# Altium schematic sheet Motor_MCU.SchDoc: Motor MCU
size A4; Author: wgl18; DrawnBy: wgl18; Organization: ENEL429 Group 9; Address1: ECE Department; Address2: University of Canterbury; Address3: Christchurch 8041; Address4: New Zealand; DocumentNumber: 1; Revision: 1; SheetNumber: 2; SheetTotal: 5; ProjectName: Wacky Racers
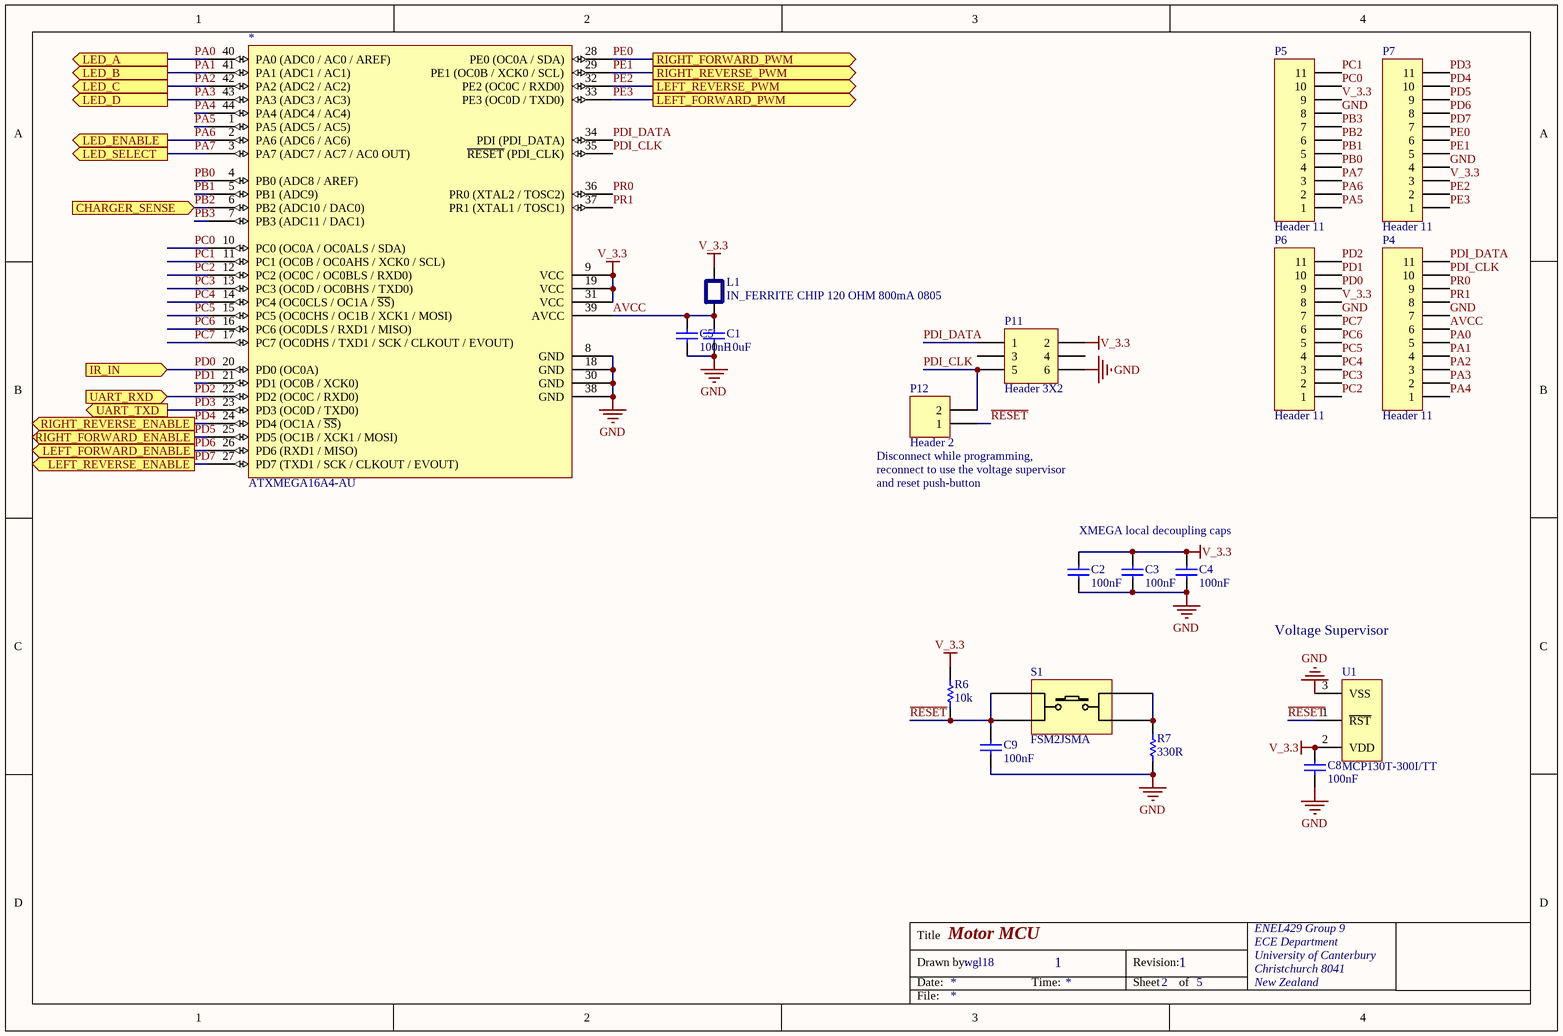
[diagram p0: Motor_MCU.SchDoc]

## Parts
*  ATXMEGA16A4-AU  [TQFP80P1200X1200X120-44N]
C1  10uF  [0805]
C2  100nF  [0603]
C3  100nF  [0603]
C4  100nF  [0603]
C5  100nF  [0603]
C8  100nF  [0603]
C9  100nF  [0603]
L1  IN_FERRITE CHIP 120 OHM 800mA 0805  [0805]
P4  Header 11  [HDR1X11]
P5  Header 11  [HDR1X11]
P6  Header 11  [HDR1X11]
P7  Header 11  [HDR1X11]
P11  Header 3X2  [HDR2X3]
P12  Header 2  [HDR1X2]
R6  10k  [0603]
R7  330R  [0603]
S1  FSM2JSMA  [FSM2JSMA]
U1  MCP130T-300I/TT  [SOT-23-TT3_N]

## Ports
CHARGER_SENSE (in), IR_IN (in), LED_A (out), LED_B (out), LED_C (out), LED_D (out), LED_ENABLE (out), LED_SELECT (out), LEFT_FORWARD_ENABLE (out), LEFT_FORWARD_PWM (out), LEFT_REVERSE_ENABLE (out), LEFT_REVERSE_PWM (out), RIGHT_FORWARD_ENABLE (out), RIGHT_FORWARD_PWM (out), RIGHT_REVERSE_ENABLE (out), RIGHT_REVERSE_PWM (out), UART_RXD (in), UART_TXD (out)

## Nets
GND: *.8(GND) *.18(GND) *.30(GND) *.38(GND) C1.2 C2.1 C3.1 C4.1 C5.1 C8.2 C9.2 P4.7 P5.8 P6.7 P7.4 P11.6 R7.1 U1.3(VSS)
V_3.3: *.9(VCC) *.19(VCC) *.31(VCC) C2.2 C3.2 C4.2 C8.1 L1.1 P5.9 P6.8 P7.3 P11.2 R6.2 U1.2(VDD)
AVCC: *.39(AVCC) C1.1 C5.2 L1.2 P4.6
PA0: *.40(PA0_(ADC0_/_AC0_/_AREF)) P4.5 ; port LED_A
PA1: *.41(PA1_(ADC1_/_AC1)) P4.4 ; port LED_B
PA2: *.42(PA2_(ADC2_/_AC2)) P4.3 ; port LED_C
PA3: *.43(PA3_(ADC3_/_AC3)) P4.2 ; port LED_D
PA4: *.44(PA4_(ADC4_/_AC4)) P4.1
PA5: *.1(PA5_(ADC5_/_AC5)) P5.1
PA6: *.2(PA6_(ADC6_/_AC6)) P5.2 ; port LED_ENABLE
PA7: *.3(PA7_(ADC7_/_AC7_/_AC0_OUT)) P5.3 ; port LED_SELECT
PB0: *.4(PB0_(ADC8_/_AREF)) P5.4
PB1: *.5(PB1_(ADC9)) P5.5
PB2: *.6(PB2_(ADC10_/_DAC0)) P5.6 ; port CHARGER_SENSE
PB3: *.7(PB3_(ADC11_/_DAC1)) P5.7
PC0: *.10(PC0_(OC0A_/_OC0ALS_/_SDA)) P5.10
PC1: *.11(PC1_(OC0B_/_OC0AHS_/_XCK0_/_SCL)) P5.11
PC2: *.12(PC2_(OC0C_/_OC0BLS_/_RXD0)) P6.1
PC3: *.13(PC3_(OC0D_/_OC0BHS_/_TXD0)) P6.2
PC4: *.14(PC4_(OC0CLS_/_OC1A_/_~{SS})) P6.3
PC5: *.15(PC5_(OC0CHS_/_OC1B_/_XCK1_/_MOSI)) P6.4
PC6: *.16(PC6_(OC0DLS_/_RXD1_/_MISO)) P6.5
PC7: *.17(PC7_(OC0DHS_/_TXD1_/_SCK_/_CLKOUT_/_EVOUT)) P6.6
PD0: *.20(PD0_(OC0A)) P6.9 ; port IR_IN
PD1: *.21(PD1_(OC0B_/_XCK0)) P6.10
PD2: *.22(PD2_(OC0C_/_RXD0)) P6.11 ; port UART_RXD
PD3: *.23(PD3_(OC0D_/_TXD0)) P7.11 ; port UART_TXD
PD4: *.24(PD4_(OC1A_/_~{SS})) P7.10 ; port RIGHT_REVERSE_ENABLE
PD5: *.25(PD5_(OC1B_/_XCK1_/_MOSI)) P7.9 ; port RIGHT_FORWARD_ENABLE
PD6: *.26(PD6_(RXD1_/_MISO)) P7.8 ; port LEFT_FORWARD_ENABLE
PD7: *.27(PD7_(TXD1_/_SCK_/_CLKOUT_/_EVOUT)) P7.7 ; port LEFT_REVERSE_ENABLE
PDI_CLK: *.35(~{RESET}_(PDI_CLK)) P4.10 P11.5 P12.2
PDI_DATA: *.34(PDI_(PDI_DATA)) P4.11 P11.1
PE0: *.28(PE0_(OC0A_/_SDA)) P7.6 ; port RIGHT_FORWARD_PWM
PE1: *.29(PE1_(OC0B_/_XCK0_/_SCL)) P7.5 ; port RIGHT_REVERSE_PWM
PE2: *.32(PE2_(OC0C_/_RXD0)) P7.2 ; port LEFT_REVERSE_PWM
PE3: *.33(PE3_(OC0D_/_TXD0)) P7.1 ; port LEFT_FORWARD_PWM
PR0: *.36(PR0_(XTAL2_/_TOSC2)) P4.9
PR1: *.37(PR1_(XTAL1_/_TOSC1)) P4.8
~{RESET}: C9.1 P12.1 R6.1 S1.1 S1.2 U1.1(~{RST})
NetR7_2: R7.2 S1.3 S1.4

Not connected (* = marked no-connect by the designer): P11 3 4

## Notes on the sheet
- (near P12) Disconnect while programming,
- (near P12) reconnect to use the voltage supervisor
- and reset push-button
- XMEGA local decoupling caps
- Voltage Supervisor
- Title
- Drawn by:
- Date:
- Time:
- Revision:
- Sheet
- of
- File:

## Library data of the parts
* = ATXMEGA16A4-AU: Manufacturer: ATMEL; Manufacturer PN: ATXMEGA16A4-AU; Supplier 1: Element 14; Supplier Part Number 1: 1748552
C1 = CP_10uF 0805: CAP 10uF 10% 10V X5R 0805; Manufacturer: Murata; Manufacturer PN: GRM219R61A106KE44D; Value: 10uF; Part Number: CP_10uF 0805; Component Kind: Standard; Component Type: Standard; Designator: CP_10uF 0805; Pin Count: 2; LatestRevisionDate: 29 May 08; Supplier 1: Digi-Key; Supplier Part Number 1: 490-4735-1-ND
C2-C5 C8 C9 = CP_100nF 0603: CAP CER .10UF 50V X5R 0603; Manufacturer: Taiyo Yuden; Manufacturer PN: UMK107B7104KA-T; Value: 100nF; Part Number: CP_100nF 0603; Component Kind: Standard; Component Type: Standard; Designator: CP_100nF 0603; Pin Count: 2; LatestRevisionDate: 29 May 08; Supplier 1: Digi-Key; Supplier Part Number 1: 478-6206-1-ND; Signal Integrity: Cap; Simulation: CAP
L1 = IN_FERRITE CHIP 120 OHM 800mA 0805: FERRITE CHIP 120 OHM 800mA 0805; Manufacturer: TDK; Manufacturer PN: MMZ2012Y121B; Part Number: IN_FERRITE CHIP 120 OHM 800mA 0805; Component Kind: Standard; Component Type: Standard; Designator: IN_FERRITE CHIP 120 OHM 800mA 0805; Pin Count: 2; Supplier 1: Digi-Key; Supplier Part Number 1: 445-2196-2-ND
P4-P7 = Header 11: Header, 11-Pin; LatestRevisionDate: 17-Jul-2002; LatestRevisionNote: Re-released for DXP Platform.; Publisher: Altium Limited
P11 = Header 3X2: Header, 3-Pin, Dual row; LatestRevisionDate: 17-Jul-2002; LatestRevisionNote: Re-released for DXP Platform.; Publisher: Altium Limited
P12 = Header 2: Header, 2-Pin; LatestRevisionDate: 17-Jul-2002; LatestRevisionNote: Re-released for DXP Platform.; Publisher: Altium Limited
R6 = RS_10k 0603: RES 10.0K OHM 1/10W 1% 0603 SMD; Manufacturer: Yageo; Manufacturer PN: RC0603FR-0710KL; Value: 10k; Part Number: RS_10k 0603; Component Kind: Standard; Component Type: Standard; Designator: RS_10k 0603; Pin Count: 2; LatestRevisionDate: 29 May 08; Supplier 1: Digi-Key; Supplier Part Number 1: 311-10.0KHRTR-ND; Signal Integrity: Res; Simulation: RESISTOR
R7 = RS_330R 0603: RES 330 OHM 1/10W 1% 0603 SMD; Manufacturer: Yageo; Manufacturer PN: RC0603FR-07330RL; Value: 330R; Part Number: RS_330R 0603; Component Kind: Standard; Component Type: Standard; Designator: RS_330R 0603; Pin Count: 2; LatestRevisionDate: 25 June 2009; Supplier 1: Digi-Key; Supplier Part Number 1: 311-330HRTR-ND; Signal Integrity: Res; Simulation: RESISTOR
S1 = SW_FSM2JSMA: DPST SMD Switch; Manufacturer: Tyco Electronics; Supplier 1: Element 14; Supplier Part Number 1: 3801287; price: 0.516; Supplier 2: Digi-Key; Supplier Part Number 2: 450-1130-ND; value: FSM2JSMA; Part Number: SW_FSM2JSMA; Component Kind: Standard; Component Type: Standard; Designator: SW_FSM2JSMA; Pin Count: 4
U1 = MCP130T-300I/TT: Microcontroller Supervisory Circuit with Open Drain Output, 3-Pin SOT-23, Industrial Temperature, Tape and Reel; FirstPublished: 29-Jan-2009; DatasheetVersion: revD, 2001; PackageVersion: revBB, Aug-2009; PackageReference: SOT-23-TT3; Publisher: Altium Limited; PackageDescription: 3-Lead Plastic Small Outline Transistor (TT) [SOT-23]; Supplier 1: Digi-Key; Supplier Part Number 1: MCP130T-300I/TTTR-ND; Supplier 2: Digi-Key; Supplier Part Number 2: MCP130T-300I/TTCT-ND; Supplier 3: Digi-Key; Supplier Part Number 3: MCP130T-300I/TTDKR-ND; Supplier 4: Farnell; Supplier Part Number 4: 1332070; Supplier 5: Newark; Supplier Part Number 5: 19C7176; Code_IPC: SOT23-3; ComponentLink1Description: Datasheet; ComponentLink1URL: http://ww1.microchip.com/downloads/en/DeviceDoc/11184d.pdf; ComponentLink2Description: Packaging Specification; ComponentLink2URL: http://www.microchip.com/stellent/groups/techpub_sg/documents/packagingspec/en012702.pdf; ComponentLink3Description: Microchip.com Home; ComponentLink3URL: http://www.microchip.com/